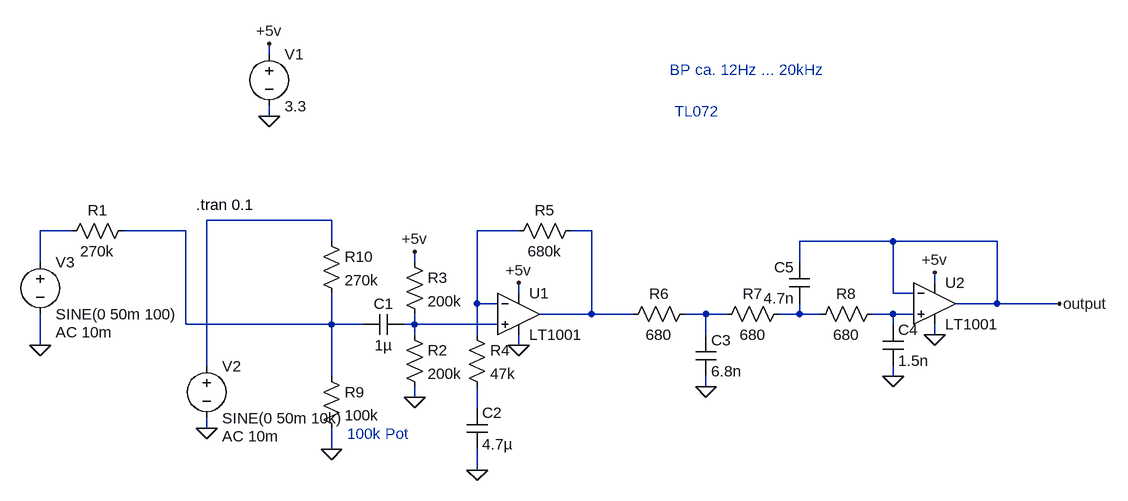
[diagram p0: schematic 1. audio input.asc]
1. audio input.asc, the LTspice schematic file:
Version 4
SHEET 1 880 680
WIRE -592 -160 -592 -176
WIRE -592 -64 -592 -80
WIRE -496 96 -688 96
WIRE -896 112 -944 112
WIRE -720 112 -816 112
WIRE -208 112 -272 112
WIRE -96 112 -128 112
WIRE -496 128 -496 96
WIRE 368 128 224 128
WIRE 528 128 368 128
WIRE -944 160 -944 112
WIRE -368 160 -368 144
WIRE 224 160 224 128
WIRE 432 192 432 176
WIRE -208 208 -208 192
WIRE 368 208 368 128
WIRE 400 208 368 208
WIRE -272 224 -272 112
WIRE -240 224 -272 224
WIRE 528 224 528 128
WIRE 528 224 464 224
WIRE 624 224 528 224
WIRE -96 240 -96 112
WIRE -96 240 -176 240
WIRE -32 240 -96 240
WIRE 80 240 48 240
WIRE 112 240 80 240
WIRE 224 240 224 224
WIRE 224 240 192 240
WIRE 256 240 224 240
WIRE 368 240 336 240
WIRE 400 240 368 240
WIRE -720 256 -720 112
WIRE -496 256 -496 208
WIRE -496 256 -720 256
WIRE -448 256 -496 256
WIRE -368 256 -368 240
WIRE -368 256 -384 256
WIRE -240 256 -368 256
WIRE 368 256 368 240
WIRE -368 272 -368 256
WIRE -272 272 -272 224
WIRE 80 272 80 240
WIRE 432 272 432 256
WIRE -944 288 -944 240
WIRE -208 288 -208 272
WIRE -688 320 -688 96
WIRE -496 336 -496 256
WIRE 368 336 368 320
WIRE 80 352 80 336
WIRE -368 368 -368 352
WIRE -272 384 -272 352
WIRE -688 416 -688 400
WIRE -496 448 -496 416
WIRE -272 480 -272 448
FLAG -592 -64 0
FLAG -592 -176 +5v
FLAG -688 416 0
FLAG -368 144 +5v
FLAG -368 368 0
FLAG -272 480 0
FLAG -208 288 0
FLAG -208 192 +5v
FLAG 80 352 0
FLAG 432 176 +5v
FLAG 432 272 0
FLAG 368 336 0
FLAG 624 224 output
FLAG -496 448 0
FLAG -944 288 0
SYMBOL voltage -592 -176 R0
WINDOW 123 0 0 Left 2
WINDOW 39 0 0 Left 2
SYMATTR InstName V1
SYMATTR Value 3.3
SYMBOL voltage -688 304 R0
WINDOW 123 24 124 Left 2
WINDOW 39 0 0 Left 2
SYMATTR Value2 AC 10m
SYMATTR InstName V2
SYMATTR Value SINE(0 50m 10k)
SYMBOL cap -384 240 R90
WINDOW 0 0 32 VBottom 2
WINDOW 3 32 32 VTop 2
SYMATTR InstName C1
SYMATTR Value 1µ
SYMBOL res -384 256 R0
SYMATTR InstName R2
SYMATTR Value 200k
SYMBOL res -384 144 R0
SYMATTR InstName R3
SYMATTR Value 200k
SYMBOL Opamps\\LT1001 -208 176 R0
SYMATTR InstName U1
SYMBOL res -288 256 R0
SYMATTR InstName R4
SYMATTR Value 47k
SYMBOL cap -288 384 R0
SYMATTR InstName C2
SYMATTR Value 4.7µ
SYMBOL res -112 96 R90
WINDOW 0 0 56 VBottom 2
WINDOW 3 32 56 VTop 2
SYMATTR InstName R5
SYMATTR Value 680k
SYMBOL res 64 224 R90
WINDOW 0 0 56 VBottom 2
WINDOW 3 32 56 VTop 2
SYMATTR InstName R6
SYMATTR Value 680
SYMBOL res 208 224 R90
WINDOW 0 0 56 VBottom 2
WINDOW 3 32 56 VTop 2
SYMATTR InstName R7
SYMATTR Value 680
SYMBOL res 352 224 R90
WINDOW 0 0 56 VBottom 2
WINDOW 3 32 56 VTop 2
SYMATTR InstName R8
SYMATTR Value 680
SYMBOL cap 64 272 R0
SYMATTR InstName C3
SYMATTR Value 6.8n
SYMBOL Opamps\\LT1001 432 160 R0
SYMATTR InstName U2
SYMBOL cap 352 256 R0
SYMATTR InstName C4
SYMATTR Value 1.5n
SYMBOL cap 240 160 M0
SYMATTR InstName C5
SYMATTR Value 4.7n
SYMBOL res -512 320 R0
SYMATTR InstName R9
SYMATTR Value 100k
SYMBOL res -512 112 R0
SYMATTR InstName R10
SYMATTR Value 270k
SYMBOL voltage -944 144 R0
WINDOW 123 24 124 Left 2
WINDOW 39 0 0 Left 2
SYMATTR Value2 AC 10m
SYMATTR InstName V3
SYMATTR Value SINE(0 50m 100)
SYMBOL res -800 96 R90
WINDOW 0 0 56 VBottom 2
WINDOW 3 32 56 VTop 2
SYMATTR InstName R1
SYMATTR Value 270k
TEXT -704 72 Left 2 !.tran 0.1
TEXT 24 -136 Left 2 ;BP ca. 12Hz ... 20kHz
TEXT 32 -72 Left 2 ;TL072
TEXT -472 424 Left 2 ;100k Pot

The netlist it stands for:
* 1. audio input.asc
V1 +5v 0 3.3
V2 N001 0 SINE(0 50m 10k) AC 10m
C1 N009 N003 1µ
R2 N009 0 200k
R3 +5v N009 200k
XU1 N009 N004 +5v 0 N005 LT1001  ; pins In+ In- V+ V- OUT
R4 N004 N010 47k
C2 N010 0 4.7µ
R5 N005 N004 680k
R6 N006 N005 680
R7 N007 N006 680
R8 N008 N007 680
C3 N006 0 6.8n
XU2 N008 output +5v 0 output LT1001  ; pins In+ In- V+ V- OUT
C4 N008 0 1.5n
C5 output N007 4.7n
R9 N003 0 100k
R10 N001 N003 270k
V3 N002 0 SINE(0 50m 100) AC 10m
R1 N003 N002 270k
.tran 0.1
* BP ca. 12Hz ... 20kHz
* TL072
* 100k Pot
.lib LTC.lib
.backanno
.end